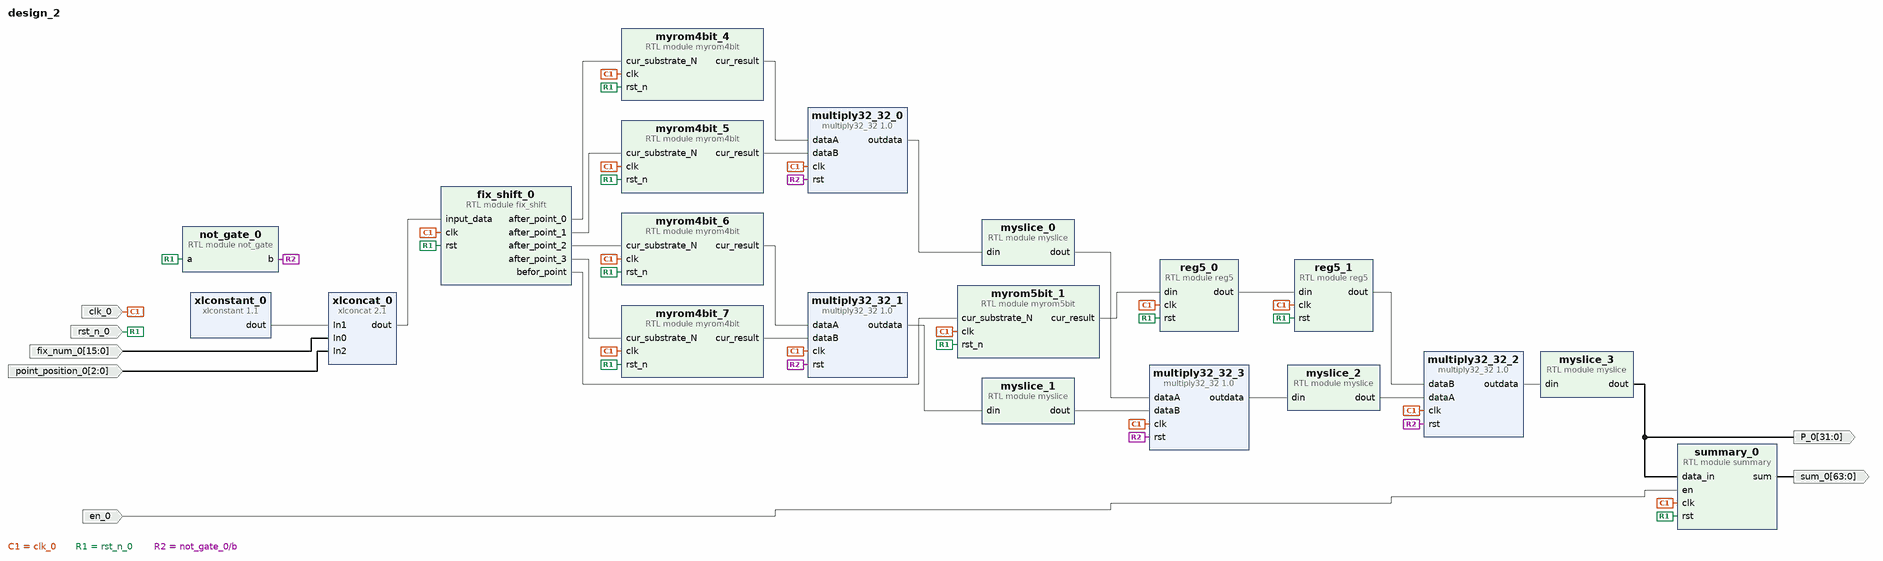
[diagram p0: block diagram of the top level]
# Vivado block design design_2, xc7z020clg484-1, Vivado 2017.4
create_bd_design design_2

create_bd_port -dir I -from 15 -to 0 fix_num_0
create_bd_port -dir I -from 2 -to 0 point_position_0
create_bd_port -dir I -type clk clk_0
create_bd_port -dir I -type rst rst_n_0
create_bd_port -dir I en_0
create_bd_port -dir O -from 63 -to 0 sum_0
create_bd_port -dir O -from 31 -to 0 -type data P_0

create_bd_cell -type ip -vlnv xilinx.com:ip:xlconcat:2.1 xlconcat_0
set_property -dict {CONFIG.NUM_PORTS 3 CONFIG.IN0_WIDTH 16 CONFIG.IN1_WIDTH 13 CONFIG.IN2_WIDTH 3} [get_bd_cells xlconcat_0]
create_bd_cell -type ip -vlnv xilinx.com:ip:xlconstant:1.1 xlconstant_0
set_property -dict {CONFIG.CONST_WIDTH 13 CONFIG.CONST_VAL 0} [get_bd_cells xlconstant_0]
create_bd_cell -type ip -vlnv xilinx.com:user:multiply32_32:1.0 multiply32_32_0
create_bd_cell -type ip -vlnv xilinx.com:user:multiply32_32:1.0 multiply32_32_1
create_bd_cell -type ip -vlnv xilinx.com:user:multiply32_32:1.0 multiply32_32_2
create_bd_cell -type ip -vlnv xilinx.com:user:multiply32_32:1.0 multiply32_32_3
create_bd_cell -type module -reference not_gate not_gate_0
create_bd_cell -type module -reference myslice myslice_0
set_property -dict [list \
  CONFIG.IN_BITS 63 \
  CONFIG.OUT_BITS 31 \
  CONFIG.SLICE_BIT_HIGH 63 \
  CONFIG.SLICE_BIT_LOW 32 \
] [get_bd_cells myslice_0]
create_bd_cell -type module -reference myslice myslice_1
set_property -dict [list \
  CONFIG.IN_BITS 63 \
  CONFIG.OUT_BITS 31 \
  CONFIG.SLICE_BIT_HIGH 63 \
  CONFIG.SLICE_BIT_LOW 32 \
] [get_bd_cells myslice_1]
create_bd_cell -type module -reference myslice myslice_2
set_property -dict [list \
  CONFIG.IN_BITS 63 \
  CONFIG.OUT_BITS 31 \
  CONFIG.SLICE_BIT_HIGH 63 \
  CONFIG.SLICE_BIT_LOW 32 \
] [get_bd_cells myslice_2]
create_bd_cell -type module -reference myslice myslice_3
set_property -dict [list \
  CONFIG.IN_BITS 63 \
  CONFIG.OUT_BITS 31 \
  CONFIG.SLICE_BIT_HIGH 63 \
  CONFIG.SLICE_BIT_LOW 32 \
] [get_bd_cells myslice_3]
create_bd_cell -type module -reference reg5 reg5_0
set_property -dict {CONFIG.BITS 31} [get_bd_cells reg5_0]
create_bd_cell -type module -reference reg5 reg5_1
set_property -dict {CONFIG.BITS 31} [get_bd_cells reg5_1]
create_bd_cell -type module -reference summary summary_0
create_bd_cell -type module -reference myrom4bit myrom4bit_4
set_property -dict [list \
  CONFIG.RESULT_00 0x0000 \
  CONFIG.RESULT_01 0x0000 \
  CONFIG.RESULT_02 0x0000 \
  CONFIG.RESULT_03 0x0000 \
  CONFIG.RESULT_04 0x0000 \
  CONFIG.RESULT_05 0x0000 \
  CONFIG.RESULT_06 0x0000 \
  CONFIG.RESULT_07 0x0000 \
  CONFIG.RESULT_08 0x0000 \
  CONFIG.RESULT_09 0x0000 \
  CONFIG.RESULT_10 0x0000 \
  CONFIG.RESULT_11 0x0000 \
  CONFIG.RESULT_12 0x0000 \
  CONFIG.RESULT_13 0x0000 \
  CONFIG.RESULT_14 0x0000 \
  CONFIG.RESULT_15 0x0000 \
] [get_bd_cells myrom4bit_4]
create_bd_cell -type module -reference myrom4bit myrom4bit_5
set_property -dict [list \
  CONFIG.RESULT_00 0x0000 \
  CONFIG.RESULT_01 0x0000 \
  CONFIG.RESULT_02 0x0000 \
  CONFIG.RESULT_03 0x0000 \
  CONFIG.RESULT_04 0x0000 \
  CONFIG.RESULT_05 0x0000 \
  CONFIG.RESULT_06 0x0000 \
  CONFIG.RESULT_07 0x0000 \
  CONFIG.RESULT_08 0x0000 \
  CONFIG.RESULT_09 0x0000 \
  CONFIG.RESULT_10 0x0000 \
  CONFIG.RESULT_11 0x0000 \
  CONFIG.RESULT_12 0x0000 \
  CONFIG.RESULT_13 0x0000 \
  CONFIG.RESULT_14 0x0000 \
  CONFIG.RESULT_15 0x0000 \
] [get_bd_cells myrom4bit_5]
create_bd_cell -type module -reference myrom4bit myrom4bit_6
set_property -dict [list \
  CONFIG.RESULT_00 0x0000 \
  CONFIG.RESULT_01 0x0000 \
  CONFIG.RESULT_02 0x0000 \
  CONFIG.RESULT_03 0x0000 \
  CONFIG.RESULT_04 0x0000 \
  CONFIG.RESULT_05 0x0000 \
  CONFIG.RESULT_06 0x0000 \
  CONFIG.RESULT_07 0x0000 \
  CONFIG.RESULT_08 0x0000 \
  CONFIG.RESULT_09 0x0000 \
  CONFIG.RESULT_10 0x0000 \
  CONFIG.RESULT_11 0x0000 \
  CONFIG.RESULT_12 0x0000 \
  CONFIG.RESULT_13 0x0000 \
  CONFIG.RESULT_14 0x0000 \
  CONFIG.RESULT_15 0x0000 \
] [get_bd_cells myrom4bit_6]
create_bd_cell -type module -reference myrom4bit myrom4bit_7
set_property -dict [list \
  CONFIG.RESULT_00 0x0000 \
  CONFIG.RESULT_01 0x0000 \
  CONFIG.RESULT_02 0x0000 \
  CONFIG.RESULT_03 0x0000 \
  CONFIG.RESULT_04 0x0000 \
  CONFIG.RESULT_05 0x0000 \
  CONFIG.RESULT_06 0x0000 \
  CONFIG.RESULT_07 0x0000 \
  CONFIG.RESULT_08 0x0000 \
  CONFIG.RESULT_09 0x0000 \
  CONFIG.RESULT_10 0x0000 \
  CONFIG.RESULT_11 0x0000 \
  CONFIG.RESULT_12 0x0000 \
  CONFIG.RESULT_13 0x0000 \
  CONFIG.RESULT_14 0x0000 \
  CONFIG.RESULT_15 0x0000 \
] [get_bd_cells myrom4bit_7]
create_bd_cell -type module -reference myrom5bit myrom5bit_1
set_property -dict [list \
  CONFIG.RESULT_00 0x0000 \
  CONFIG.RESULT_01 0x0000 \
  CONFIG.RESULT_02 0x0000 \
  CONFIG.RESULT_03 0x0000 \
  CONFIG.RESULT_04 0x0000 \
  CONFIG.RESULT_05 0x0000 \
  CONFIG.RESULT_06 0x0000 \
  CONFIG.RESULT_07 0x0000 \
  CONFIG.RESULT_08 0x0000 \
  CONFIG.RESULT_09 0x0000 \
  CONFIG.RESULT_10 0x0000 \
  CONFIG.RESULT_11 0x8C1A \
  CONFIG.RESULT_12 0x338A \
  CONFIG.RESULT_13 0x12F6 \
  CONFIG.RESULT_14 0x06F9 \
  CONFIG.RESULT_15 0x0290 \
  CONFIG.RESULT_16 0x00F1 \
  CONFIG.RESULT_17 0x0058 \
  CONFIG.RESULT_18 0x0020 \
  CONFIG.RESULT_19 0x000C \
  CONFIG.RESULT_20 0x0004 \
  CONFIG.RESULT_21 0x0001 \
  CONFIG.RESULT_22 0x0000 \
  CONFIG.RESULT_23 0x0000 \
  CONFIG.RESULT_24 0x0000 \
  CONFIG.RESULT_25 0x0000 \
  CONFIG.RESULT_26 0x0000 \
  CONFIG.RESULT_27 0x0000 \
  CONFIG.RESULT_28 0x0000 \
  CONFIG.RESULT_29 0x0000 \
  CONFIG.RESULT_30 0x0000 \
  CONFIG.RESULT_31 0x0000 \
] [get_bd_cells myrom5bit_1]
create_bd_cell -type module -reference fix_shift fix_shift_0

# ---- connections ----

connect_bd_net -net fix_num_0_1 [get_bd_ports fix_num_0] [get_bd_pins xlconcat_0/In0]
connect_bd_net -net point_position_0_1 [get_bd_ports point_position_0] [get_bd_pins xlconcat_0/In2]
connect_bd_net [get_bd_pins fix_shift_0/befor_point] [get_bd_pins myrom5bit_1/cur_substrate_N]
connect_bd_net [get_bd_pins fix_shift_0/after_point_0] [get_bd_pins myrom4bit_4/cur_substrate_N]
connect_bd_net [get_bd_pins fix_shift_0/after_point_1] [get_bd_pins myrom4bit_5/cur_substrate_N]
connect_bd_net [get_bd_pins fix_shift_0/after_point_2] [get_bd_pins myrom4bit_6/cur_substrate_N]
connect_bd_net -net clk_0_1 [get_bd_ports clk_0] \
  [get_bd_pins multiply32_32_1/clk] [get_bd_pins multiply32_32_0/clk] [get_bd_pins multiply32_32_3/clk] \
  [get_bd_pins multiply32_32_2/clk] [get_bd_pins reg5_0/clk] [get_bd_pins reg5_1/clk] [get_bd_pins summary_0/clk] \
  [get_bd_pins myrom4bit_4/clk] [get_bd_pins myrom4bit_5/clk] [get_bd_pins myrom4bit_6/clk] [get_bd_pins myrom4bit_7/clk] \
  [get_bd_pins myrom5bit_1/clk] [get_bd_pins fix_shift_0/clk]
connect_bd_net -net rst_n_0_1 [get_bd_ports rst_n_0] \
  [get_bd_pins not_gate_0/a] [get_bd_pins reg5_0/rst] [get_bd_pins reg5_1/rst] [get_bd_pins summary_0/rst] \
  [get_bd_pins myrom4bit_4/rst_n] [get_bd_pins myrom4bit_5/rst_n] [get_bd_pins myrom4bit_6/rst_n] \
  [get_bd_pins myrom4bit_7/rst_n] [get_bd_pins myrom5bit_1/rst_n] [get_bd_pins fix_shift_0/rst]
connect_bd_net [get_bd_pins fix_shift_0/after_point_3] [get_bd_pins myrom4bit_7/cur_substrate_N]
connect_bd_net -net en_0_1 [get_bd_ports en_0] [get_bd_pins summary_0/en]
connect_bd_net [get_bd_pins summary_0/sum] [get_bd_ports sum_0]
connect_bd_net -net mult_gen_0_P [get_bd_pins myslice_3/dout] [get_bd_ports P_0] [get_bd_pins summary_0/data_in]
connect_bd_net [get_bd_pins xlconstant_0/dout] [get_bd_pins xlconcat_0/In1]
connect_bd_net [get_bd_pins xlconcat_0/dout] [get_bd_pins fix_shift_0/input_data]
connect_bd_net [get_bd_pins myrom4bit_4/cur_result] [get_bd_pins multiply32_32_0/dataA]
connect_bd_net [get_bd_pins myrom4bit_5/cur_result] [get_bd_pins multiply32_32_0/dataB]
connect_bd_net [get_bd_pins myrom4bit_6/cur_result] [get_bd_pins multiply32_32_1/dataA]
connect_bd_net [get_bd_pins myrom4bit_7/cur_result] [get_bd_pins multiply32_32_1/dataB]
connect_bd_net [get_bd_pins not_gate_0/b] \
  [get_bd_pins multiply32_32_0/rst] [get_bd_pins multiply32_32_3/rst] [get_bd_pins multiply32_32_1/rst] \
  [get_bd_pins multiply32_32_2/rst]
connect_bd_net [get_bd_pins multiply32_32_0/outdata] [get_bd_pins myslice_0/din]
connect_bd_net [get_bd_pins multiply32_32_1/outdata] [get_bd_pins myslice_1/din]
connect_bd_net [get_bd_pins myslice_0/dout] [get_bd_pins multiply32_32_3/dataA]
connect_bd_net [get_bd_pins myslice_1/dout] [get_bd_pins multiply32_32_3/dataB]
connect_bd_net [get_bd_pins multiply32_32_3/outdata] [get_bd_pins myslice_2/din]
connect_bd_net [get_bd_pins myslice_2/dout] [get_bd_pins multiply32_32_2/dataA]
connect_bd_net [get_bd_pins multiply32_32_2/outdata] [get_bd_pins myslice_3/din]
connect_bd_net [get_bd_pins myrom5bit_1/cur_result] [get_bd_pins reg5_0/din]
connect_bd_net [get_bd_pins reg5_0/dout] [get_bd_pins reg5_1/din]
connect_bd_net [get_bd_pins reg5_1/dout] [get_bd_pins multiply32_32_2/dataB]

validate_bd_design
save_bd_design
